# Altium schematic sheet A200T Top Level.SchDoc
size A1; SheetNumber: 2; SheetTotal: 5
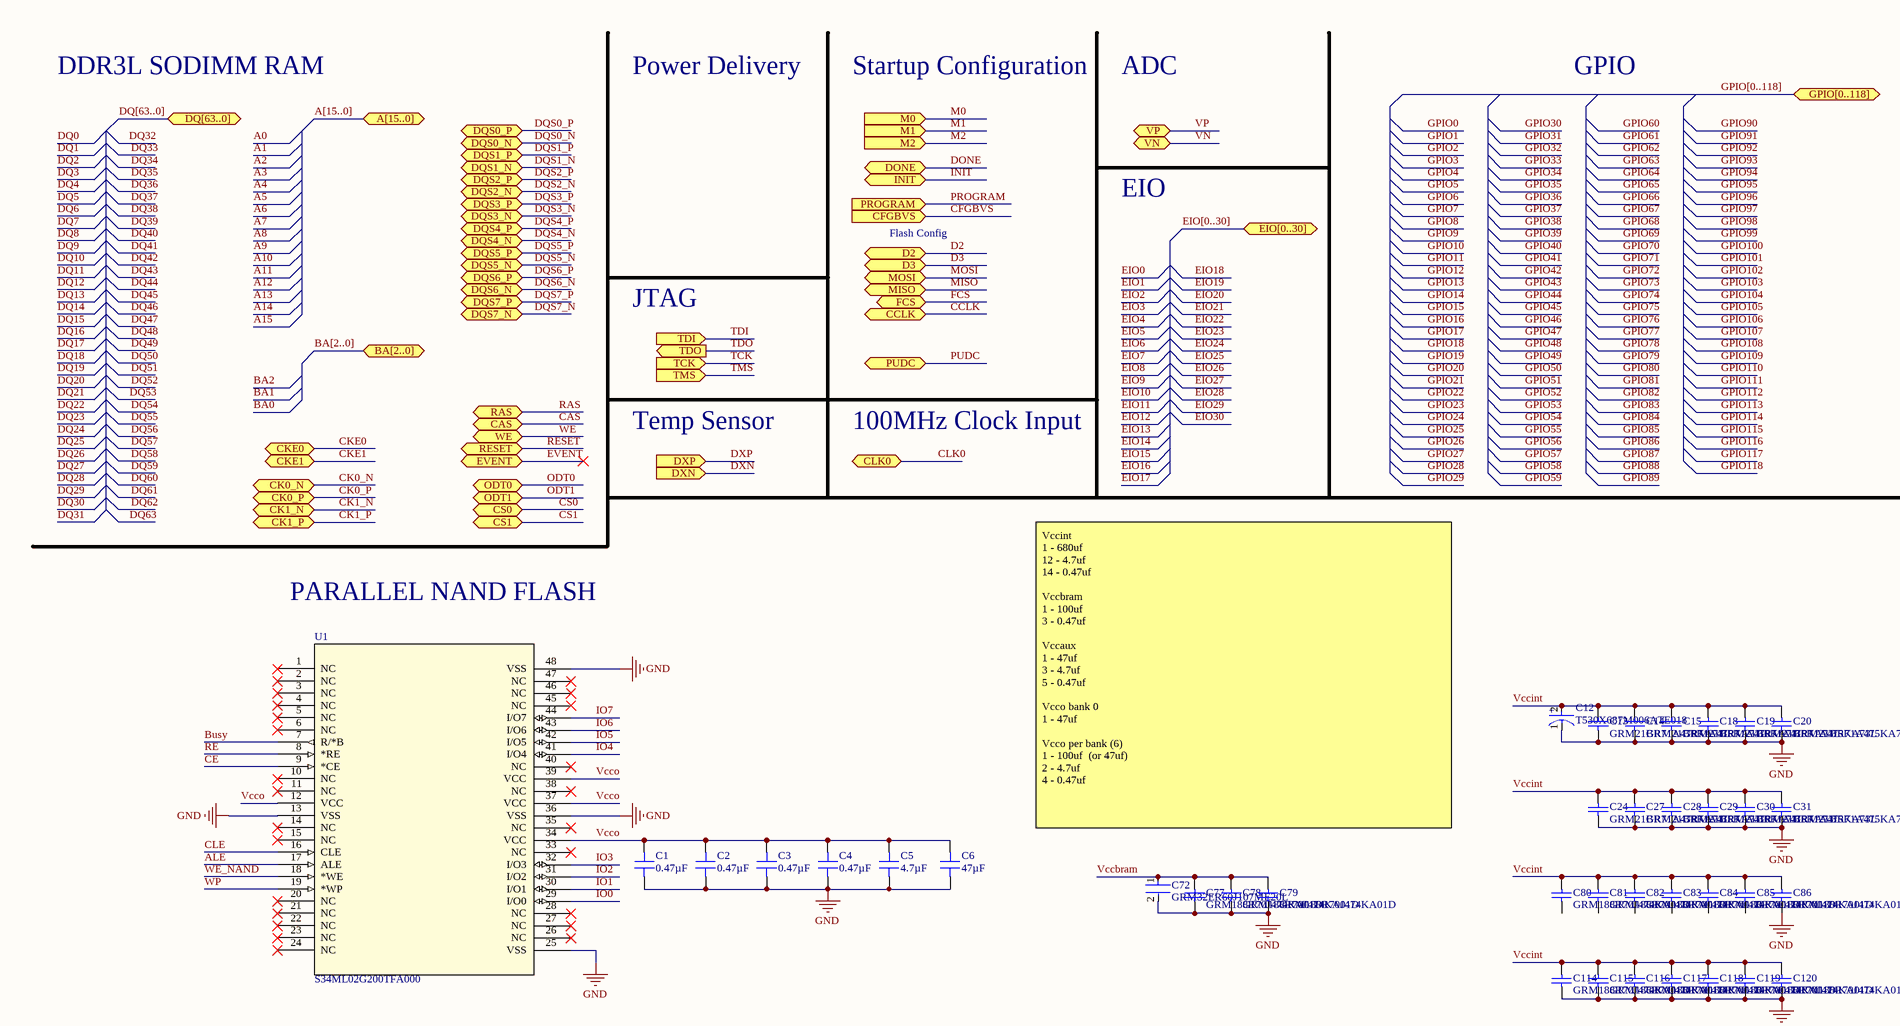
[diagram p0: A200T Top Level.SchDoc, top left]
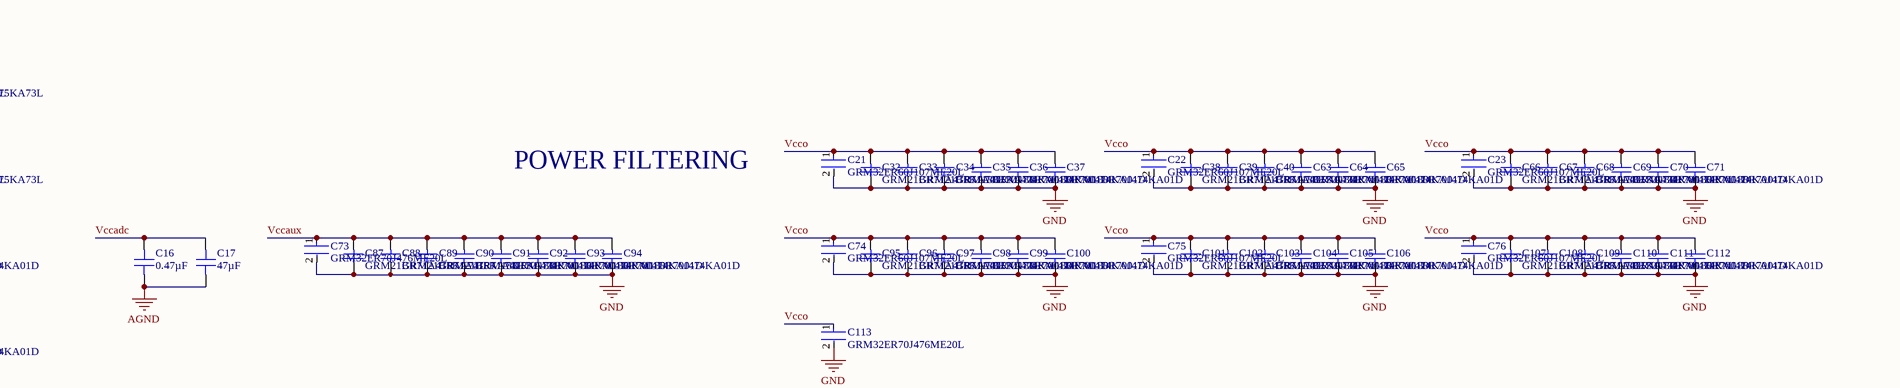
[diagram p1: A200T Top Level.SchDoc, top right]
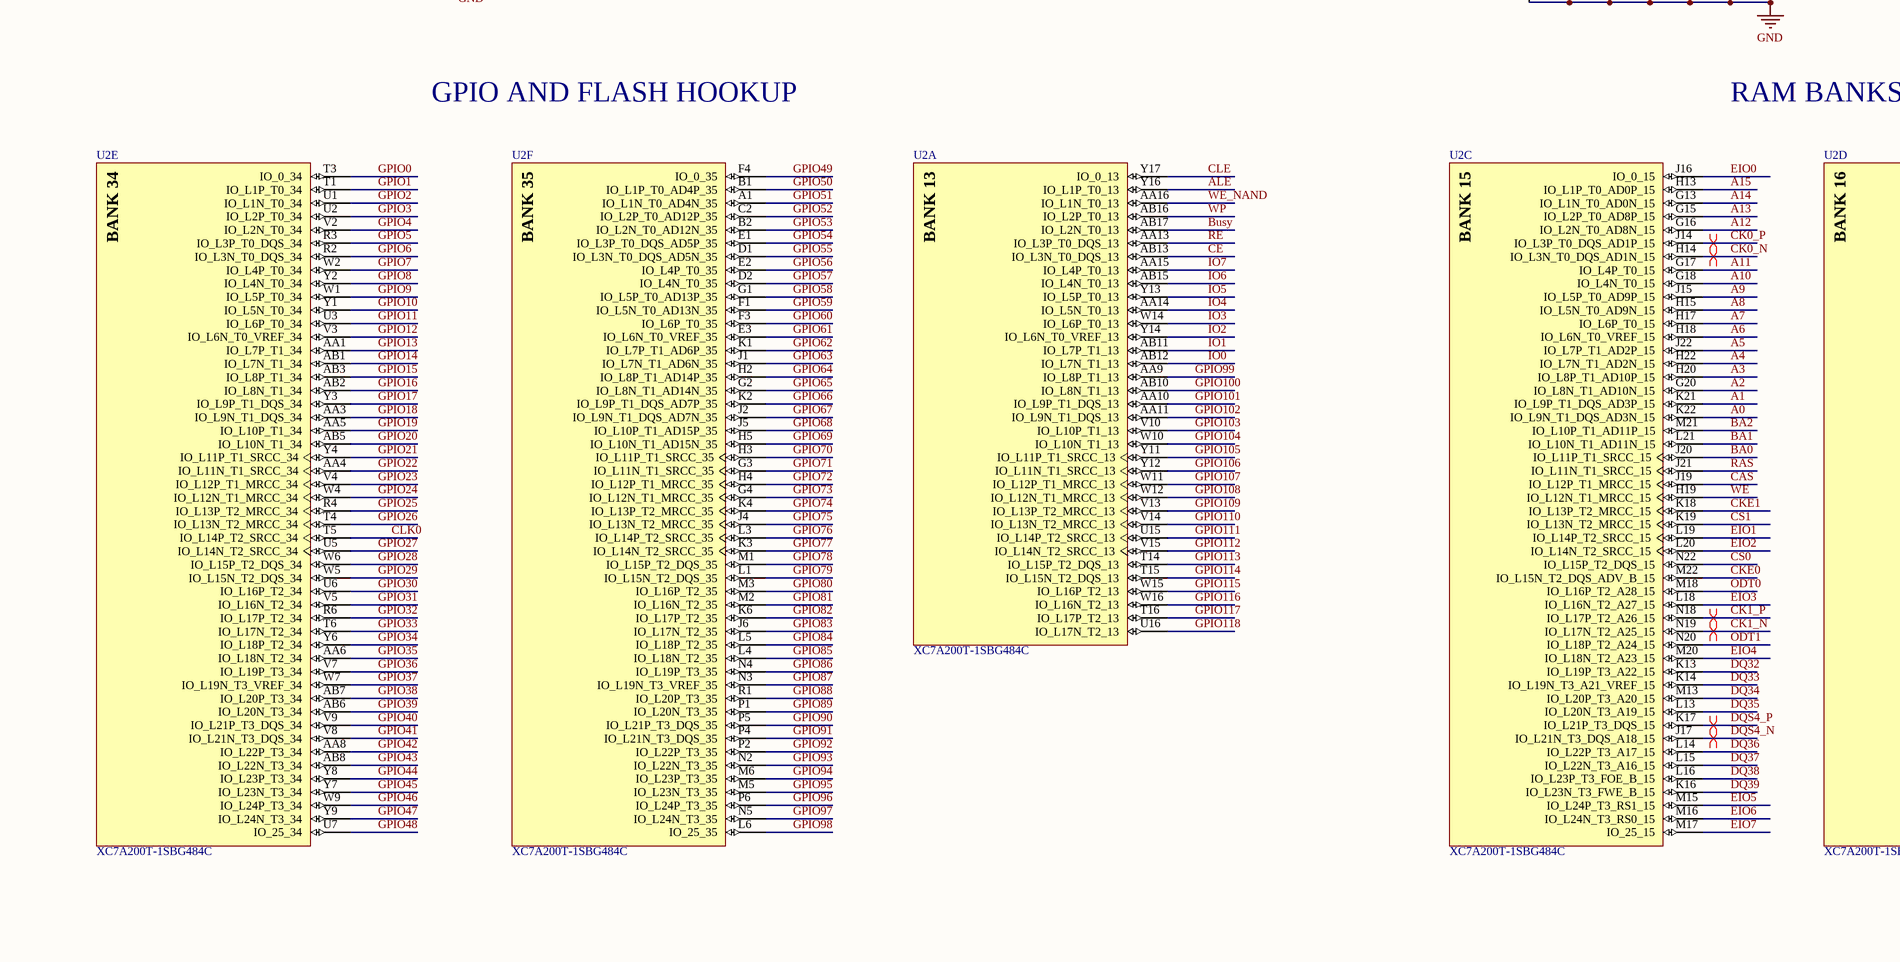
[diagram p2: A200T Top Level.SchDoc, bottom left]
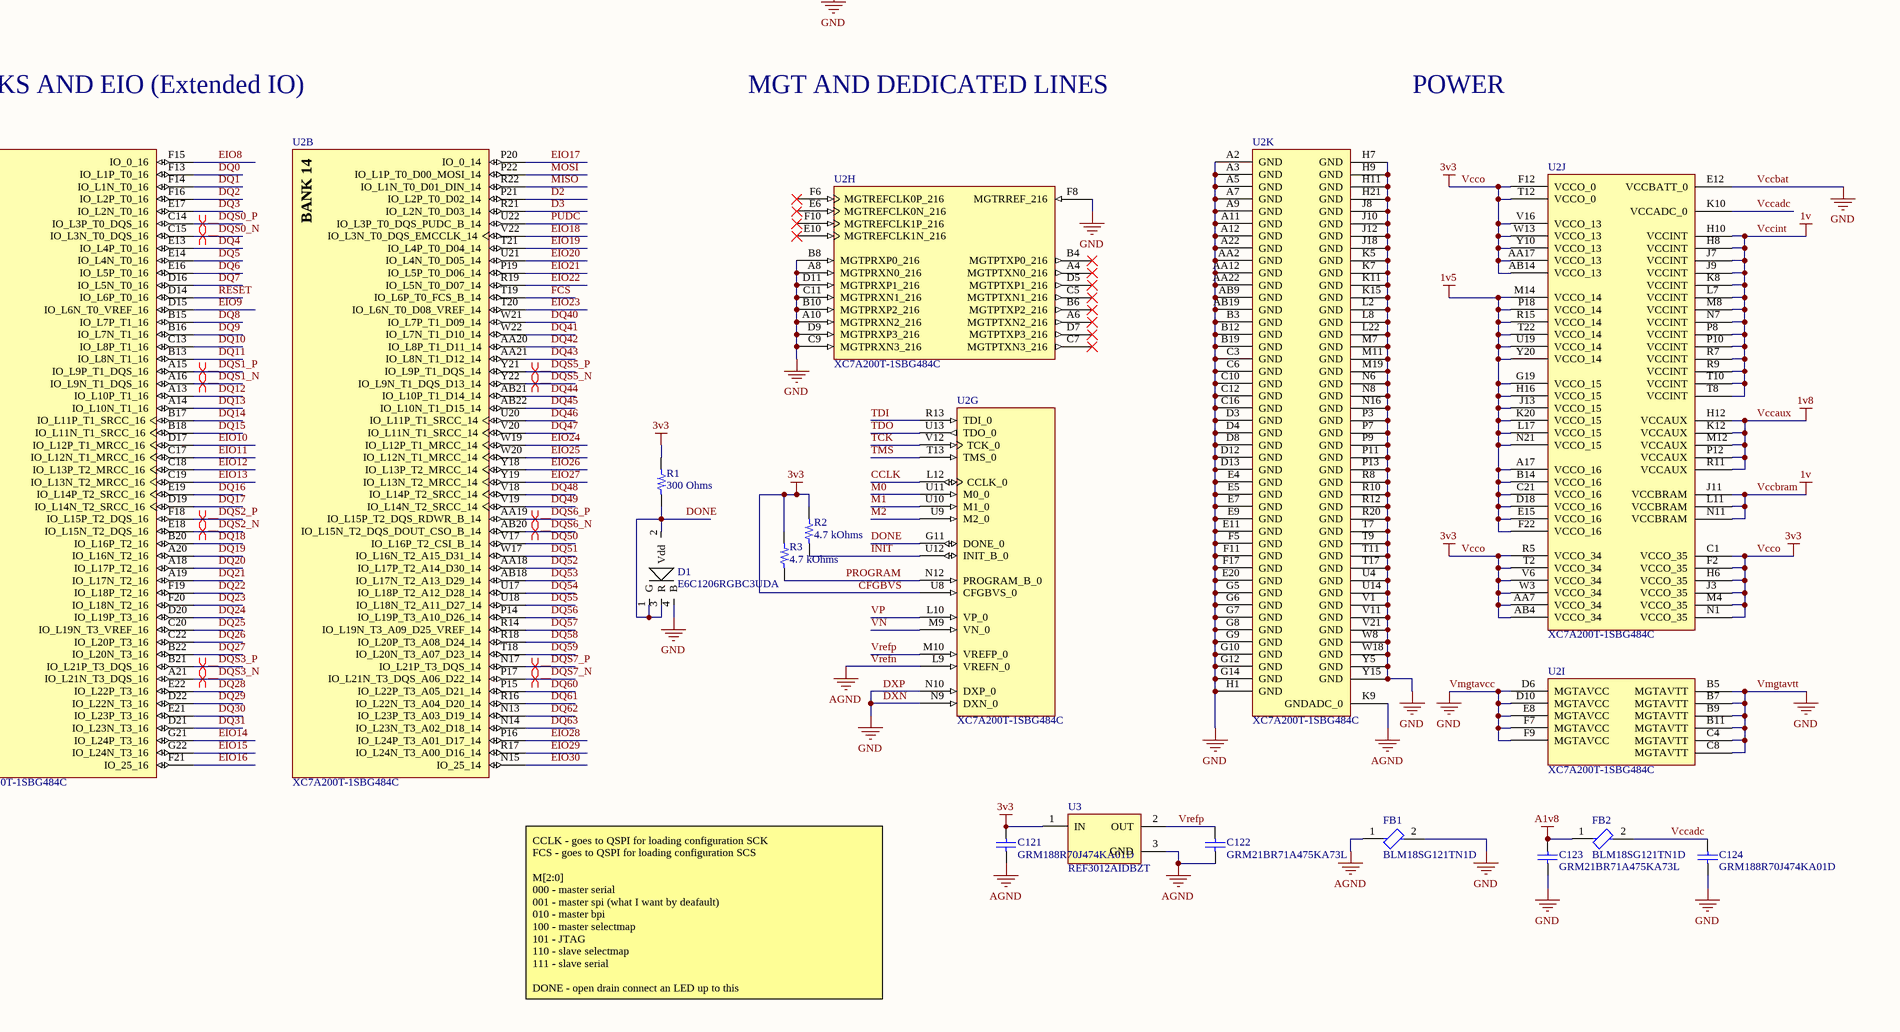
[diagram p3: A200T Top Level.SchDoc, bottom right]

## Parts
C1  0.47µF  [CAP 0603_1608]
C2  0.47µF  [CAP 0603_1608]
C3  0.47µF  [CAP 0603_1608]
C4  0.47µF  [CAP 0603_1608]
C5  4.7µF  [CAP 0603_1608]
C6  47µF  [CAP 0805_2012]
C12  T530X687M006ATE018  [FP-T530X687M006ATE018-MFG]
C13  GRM21BR71A475KA73L  [CAPC2013X135X45LL10T25]
C14  GRM21BR71A475KA73L  [CAPC2013X135X45LL10T25]
C15  GRM21BR71A475KA73L  [CAPC2013X135X45LL10T25]
C16  0.47µF  [CAP 0603_1608]
C17  47µF  [CAP 0805_2012]
C18  GRM21BR71A475KA73L  [CAPC2013X135X45LL10T25]
C19  GRM21BR71A475KA73L  [CAPC2013X135X45LL10T25]
C20  GRM21BR71A475KA73L  [CAPC2013X135X45LL10T25]
C21  GRM32ER60J107ME20L  [FP-GRM32-0_3-MFG]
C22  GRM32ER60J107ME20L  [FP-GRM32-0_3-MFG]
C23  GRM32ER60J107ME20L  [FP-GRM32-0_3-MFG]
C24  GRM21BR71A475KA73L  [CAPC2013X135X45LL10T25]
C27  GRM21BR71A475KA73L  [CAPC2013X135X45LL10T25]
C28  GRM21BR71A475KA73L  [CAPC2013X135X45LL10T25]
C29  GRM21BR71A475KA73L  [CAPC2013X135X45LL10T25]
C30  GRM21BR71A475KA73L  [CAPC2013X135X45LL10T25]
C31  GRM21BR71A475KA73L  [CAPC2013X135X45LL10T25]
C32  GRM21BR71A475KA73L  [CAPC2013X135X45LL10T25]
C33  GRM21BR71A475KA73L  [CAPC2013X135X45LL10T25]
C34  GRM188R70J474KA01D  [CAPC1608X90X35LL10T15]
C35  GRM188R70J474KA01D  [CAPC1608X90X35LL10T15]
C36  GRM188R70J474KA01D  [CAPC1608X90X35LL10T15]
C37  GRM188R70J474KA01D  [CAPC1608X90X35LL10T15]
C38  GRM21BR71A475KA73L  [CAPC2013X135X45LL10T25]
C39  GRM21BR71A475KA73L  [CAPC2013X135X45LL10T25]
C40  GRM188R70J474KA01D  [CAPC1608X90X35LL10T15]
C63  GRM188R70J474KA01D  [CAPC1608X90X35LL10T15]
C64  GRM188R70J474KA01D  [CAPC1608X90X35LL10T15]
C65  GRM188R70J474KA01D  [CAPC1608X90X35LL10T15]
C66  GRM21BR71A475KA73L  [CAPC2013X135X45LL10T25]
C67  GRM21BR71A475KA73L  [CAPC2013X135X45LL10T25]
C68  GRM188R70J474KA01D  [CAPC1608X90X35LL10T15]
C69  GRM188R70J474KA01D  [CAPC1608X90X35LL10T15]
C70  GRM188R70J474KA01D  [CAPC1608X90X35LL10T15]
C71  GRM188R70J474KA01D  [CAPC1608X90X35LL10T15]
C72  GRM32ER60J107ME20L  [FP-GRM32-0_3-MFG]
C73  GRM32ER70J476ME20L  [FP-GRM32E-0_3-0_2-IPC_C]
C74  GRM32ER60J107ME20L  [FP-GRM32-0_3-MFG]
C75  GRM32ER60J107ME20L  [FP-GRM32-0_3-MFG]
C76  GRM32ER60J107ME20L  [FP-GRM32-0_3-MFG]
C77  GRM188R70J474KA01D  [CAPC1608X90X35LL10T15]
C78  GRM188R70J474KA01D  [CAPC1608X90X35LL10T15]
C79  GRM188R70J474KA01D  [CAPC1608X90X35LL10T15]
C80  GRM188R70J474KA01D  [CAPC1608X90X35LL10T15]
C81  GRM188R70J474KA01D  [CAPC1608X90X35LL10T15]
C82  GRM188R70J474KA01D  [CAPC1608X90X35LL10T15]
C83  GRM188R70J474KA01D  [CAPC1608X90X35LL10T15]
C84  GRM188R70J474KA01D  [CAPC1608X90X35LL10T15]
C85  GRM188R70J474KA01D  [CAPC1608X90X35LL10T15]
C86  GRM188R70J474KA01D  [CAPC1608X90X35LL10T15]
C87  GRM21BR71A475KA73L  [CAPC2013X135X45LL10T25]
C88  GRM21BR71A475KA73L  [CAPC2013X135X45LL10T25]
C89  GRM21BR71A475KA73L  [CAPC2013X135X45LL10T25]
C90  GRM188R70J474KA01D  [CAPC1608X90X35LL10T15]
C91  GRM188R70J474KA01D  [CAPC1608X90X35LL10T15]
C92  GRM188R70J474KA01D  [CAPC1608X90X35LL10T15]
C93  GRM188R70J474KA01D  [CAPC1608X90X35LL10T15]
C94  GRM188R70J474KA01D  [CAPC1608X90X35LL10T15]
C95  GRM21BR71A475KA73L  [CAPC2013X135X45LL10T25]
C96  GRM21BR71A475KA73L  [CAPC2013X135X45LL10T25]
C97  GRM188R70J474KA01D  [CAPC1608X90X35LL10T15]
C98  GRM188R70J474KA01D  [CAPC1608X90X35LL10T15]
C99  GRM188R70J474KA01D  [CAPC1608X90X35LL10T15]
C100  GRM188R70J474KA01D  [CAPC1608X90X35LL10T15]
C101  GRM21BR71A475KA73L  [CAPC2013X135X45LL10T25]
C102  GRM21BR71A475KA73L  [CAPC2013X135X45LL10T25]
C103  GRM188R70J474KA01D  [CAPC1608X90X35LL10T15]
C104  GRM188R70J474KA01D  [CAPC1608X90X35LL10T15]
C105  GRM188R70J474KA01D  [CAPC1608X90X35LL10T15]
C106  GRM188R70J474KA01D  [CAPC1608X90X35LL10T15]
C107  GRM21BR71A475KA73L  [CAPC2013X135X45LL10T25]
C108  GRM21BR71A475KA73L  [CAPC2013X135X45LL10T25]
C109  GRM188R70J474KA01D  [CAPC1608X90X35LL10T15]
C110  GRM188R70J474KA01D  [CAPC1608X90X35LL10T15]
C111  GRM188R70J474KA01D  [CAPC1608X90X35LL10T15]
C112  GRM188R70J474KA01D  [CAPC1608X90X35LL10T15]
C113  GRM32ER70J476ME20L  [FP-GRM32E-0_3-0_2-IPC_C]
C114  GRM188R70J474KA01D  [CAPC1608X90X35LL10T15]
C115  GRM188R70J474KA01D  [CAPC1608X90X35LL10T15]
C116  GRM188R70J474KA01D  [CAPC1608X90X35LL10T15]
C117  GRM188R70J474KA01D  [CAPC1608X90X35LL10T15]
C118  GRM188R70J474KA01D  [CAPC1608X90X35LL10T15]
C119  GRM188R70J474KA01D  [CAPC1608X90X35LL10T15]
C120  GRM188R70J474KA01D  [CAPC1608X90X35LL10T15]
C121  GRM188R70J474KA01D  [CAPC1608X90X35LL10T15]
C122  GRM21BR71A475KA73L  [CAPC2013X135X45LL10T25]
C123  GRM21BR71A475KA73L  [CAPC2013X135X45LL10T25]
C124  GRM188R70J474KA01D  [CAPC1608X90X35LL10T15]
D1  E6C1206RGBC3UDA  [E6C1206RGBC3UDA]
FB1  BLM18SG121TN1D  [FP-BLM18-0_15-t0_5-d1_2-MFG]
FB2  BLM18SG121TN1D  [FP-BLM18-0_15-t0_5-d1_2-MFG]
R1  300 Ohms  [RES 0603_1608]
R2  4.7 kOhms  [RES 0603_1608]
R3  4.7 kOhms  [RES 0603_1608]
U1  S34ML02G200TFA000  [TSOP-48_TSOP1_SPA]
U2  XC7A200T-1SBG484C  [SBG484]  (parts A,B,C,D,E,F,G,H,I,J,K of 11)
U3  REF3012AIDBZT  [DBZ0003A_L]

## Ports
A[15..0] (bidir), BA[2..0] (bidir), CAS (bidir), CCLK (bidir), CFGBVS (in), CK0_N (bidir), CK0_P (bidir), CK1_N (bidir), CK1_P (bidir), CKE0 (bidir), CKE1 (bidir), CLK0 (bidir), CS0 (bidir), CS1 (bidir), D2 (bidir), D3 (bidir), DONE (bidir), DQ[63..0] (bidir), DQS0_N (bidir), DQS0_P (bidir), DQS1_N (bidir), DQS1_P (bidir), DQS2_N (bidir), DQS2_P (bidir), DQS3_N (bidir), DQS3_P (bidir), DQS4_N (bidir), DQS4_P (bidir), DQS5_N (bidir), DQS5_P (bidir), DQS6_N (bidir), DQS6_P (bidir), DQS7_N (bidir), DQS7_P (bidir), DXN (in), DXP (in), EIO[0..30] (bidir), EVENT (bidir), FCS (bidir), GPIO[0..118] (bidir), INIT (bidir), M0 (in), M1 (in), M2 (in), MISO (bidir), MOSI (bidir), ODT0 (bidir), ODT1 (bidir), PROGRAM (in), PUDC (bidir), RAS (bidir), RESET (bidir), TCK (in), TDI (in), TDO (out), TMS (in), VN (bidir), VP (bidir), WE (bidir)

## Nets
1v5: U2.A17(VCCO_16) U2.B14(VCCO_16) U2.C21(VCCO_16) U2.D18(VCCO_16) U2.E15(VCCO_16) U2.F22(VCCO_16) U2.G19(VCCO_15) U2.H16(VCCO_15) U2.J13(VCCO_15) U2.K20(VCCO_15) U2.L17(VCCO_15) U2.M14(VCCO_14) U2.N21(VCCO_15) U2.P18(VCCO_14) U2.R15(VCCO_14) U2.T22(VCCO_14) U2.U19(VCCO_14) U2.Y20(VCCO_14)
A1v8: C123.2 FB2.1
CFGBVS: C1.2 C2.2 C3.2 C4.2 C5.2 C6.2 C21.1 C22.1 C23.1 C32.2 C33.2 C34.2 C35.2 C36.2 C37.2 C38.2 C39.2 C40.2 C63.2 C64.2 C65.2 C66.2 C67.2 C68.2 C69.2 C70.2 C71.2 C74.1 C75.1 C76.1 C95.2 C96.2 C97.2 C98.2 C99.2 C100.2 C101.2 C102.2 C103.2 C104.2 C105.2 C106.2 C107.2 C108.2 C109.2 C110.2 C111.2 C112.2 C113.1 C121.2 R1.2 R2.2 R3.2 U1.12(VCC) U1.34(VCC) U1.37(VCC) U1.39(VCC) U2.AA7(VCCO_34) U2.AA17(VCCO_13) U2.AB4(VCCO_34) U2.AB14(VCCO_13) U2.C1(VCCO_35) U2.F2(VCCO_35) U2.F12(VCCO_0) U2.H6(VCCO_35) U2.J3(VCCO_35) U2.M4(VCCO_35) U2.N1(VCCO_35) U2.R5(VCCO_34) U2.T2(VCCO_34) U2.T12(VCCO_0) U2.U8(CFGBVS_0) U2.V6(VCCO_34) U2.V16(VCCO_13) U2.W3(VCCO_34) U2.W13(VCCO_13) U2.Y10(VCCO_13) U3.1(IN) ; port CFGBVS  [also labelled 3v3, Vcco]
DXN: C1.1 C2.1 C3.1 C4.1 C5.1 C6.1 C12.1(C) C13.1 C14.1 C15.1 C18.1 C19.1 C20.1 C21.2 C22.2 C23.2 C24.1 C27.1 C28.1 C29.1 C30.1 C31.1 C32.1 C33.1 C34.1 C35.1 C36.1 C37.1 C38.1 C39.1 C40.1 C63.1 C64.1 C65.1 C66.1 C67.1 C68.1 C69.1 C70.1 C71.1 C72.2 C73.2 C74.2 C75.2 C76.2 C77.1 C78.1 C79.1 C86.1 C87.1 C88.1 C89.1 C90.1 C91.1 C92.1 C93.1 C94.1 C95.1 C96.1 C97.1 C98.1 C99.1 C100.1 C101.1 C102.1 C103.1 C104.1 C105.1 C106.1 C107.1 C108.1 C109.1 C110.1 C111.1 C112.1 C113.2 C114.1 C115.1 C116.1 C117.1 C118.1 C119.1 C120.1 C123.1 C124.1 D1.4(B) FB1.2 U1.13(VSS) U1.25(VSS) U1.36(VSS) U1.48(VSS) U2.A2(GND) U2.A3(GND) U2.A5(GND) U2.A7(GND) U2.A8(MGTPRXN0_216) U2.A9(GND) U2.A10(MGTPRXN2_216) U2.A11(GND) U2.A12(GND) U2.A22(GND) U2.AA2(GND) U2.AA12(GND) U2.AA22(GND) U2.AB9(GND) U2.AB19(GND) U2.B3(GND) U2.B5(MGTAVTT) U2.B7(MGTAVTT) U2.B8(MGTPRXP0_216) U2.B9(MGTAVTT) U2.B10(MGTPRXP2_216) U2.B11(MGTAVTT) U2.B12(GND) U2.B19(GND) U2.C3(GND) U2.C4(MGTAVTT) U2.C6(GND) U2.C8(MGTAVTT) U2.C9(MGTPRXN3_216) U2.C10(GND) U2.C11(MGTPRXN1_216) U2.C12(GND) U2.C16(GND) U2.D3(GND) U2.D4(GND) U2.D6(MGTAVCC) U2.D8(GND) U2.D9(MGTPRXP3_216) U2.D10(MGTAVCC) U2.D11(MGTPRXP1_216) U2.D12(GND) U2.D13(GND) U2.E4(GND) U2.E5(GND) U2.E7(GND) U2.E8(MGTAVCC) U2.E9(GND) U2.E11(GND) U2.E12(VCCBATT_0) U2.E20(GND) U2.F5(GND) U2.F7(MGTAVCC) U2.F8(MGTRREF_216) U2.F9(MGTAVCC) U2.F11(GND) U2.F17(GND) U2.G5(GND) U2.G6(GND) U2.G7(GND) U2.G8(GND) U2.G9(GND) U2.G10(GND) U2.G12(GND) U2.G14(GND) U2.H1(GND) U2.H7(GND) U2.H9(GND) U2.H11(GND) U2.H21(GND) U2.J8(GND) U2.J10(GND) U2.J12(GND) U2.J18(GND) U2.K5(GND) U2.K7(GND) U2.K11(GND) U2.K15(GND) U2.L2(GND) U2.L8(GND) U2.L22(GND) U2.M7(GND) U2.M11(GND) U2.M19(GND) U2.N6(GND) U2.N8(GND) U2.N9(DXN_0) U2.N10(DXP_0) U2.N16(GND) U2.P3(GND) U2.P7(GND) U2.P9(GND) U2.P11(GND) U2.P13(GND) U2.R8(GND) U2.R10(GND) U2.R12(GND) U2.R20(GND) U2.T7(GND) U2.T9(GND) U2.T11(GND) U2.T17(GND) U2.U4(GND) U2.U14(GND) U2.V1(GND) U2.V11(GND) U2.V21(GND) U2.W8(GND) U2.W18(GND) U2.Y5(GND) U2.Y15(GND) ; port DXP, port DXN  [also labelled DXP, GND, Vccbat, Vmgtavcc, Vmgtavtt]
Vccaux: C73.1 C87.2 C88.2 C89.2 C90.2 C91.2 C92.2 C93.2 C94.2 U2.H12(VCCAUX) U2.K12(VCCAUX) U2.M12(VCCAUX) U2.P12(VCCAUX) U2.R11(VCCAUX)  [also labelled 1v8]
Vccbram: C12.2(A) C13.2 C14.2 C15.2 C18.2 C19.2 C20.2 C24.2 C27.2 C28.2 C29.2 C30.2 C31.2 C72.1 C77.2 C78.2 C79.2 C80.2 C81.2 C82.2 C83.2 C84.2 C85.2 C86.2 C114.2 C115.2 C116.2 C117.2 C118.2 C119.2 C120.2 U2.H8(VCCINT) U2.H10(VCCINT) U2.J7(VCCINT) U2.J9(VCCINT) U2.J11(VCCBRAM) U2.K8(VCCINT) U2.L7(VCCINT) U2.L11(VCCBRAM) U2.M8(VCCINT) U2.N7(VCCINT) U2.N11(VCCBRAM) U2.P8(VCCINT) U2.P10(VCCINT) U2.R7(VCCINT) U2.R9(VCCINT) U2.T8(VCCINT) U2.T10(VCCINT)  [also labelled 1v, Vccint]
Vrefn: C16.1 C17.1 C121.1 C122.1 FB1.1 U2.K9(GNDADC_0) U2.L9(VREFN_0) U3.3(GND)  [also labelled AGND]
A0: U2.K22(IO_L9N_T1_DQS_AD3N_15)
A1: U2.K21(IO_L9P_T1_DQS_AD3P_15)
A2: U2.G20(IO_L8N_T1_AD10N_15)
A3: U2.H20(IO_L8P_T1_AD10P_15)
A4: U2.H22(IO_L7N_T1_AD2N_15)
A5: U2.J22(IO_L7P_T1_AD2P_15)
A6: U2.H18(IO_L6N_T0_VREF_15)
A7: U2.H17(IO_L6P_T0_15)
A8: U2.H15(IO_L5N_T0_AD9N_15)
A9: U2.J15(IO_L5P_T0_AD9P_15)
A10: U2.G18(IO_L4N_T0_15)
A11: U2.G17(IO_L4P_T0_15)
A12: U2.G16(IO_L2N_T0_AD8N_15)
A13: U2.G15(IO_L2P_T0_AD8P_15)
A14: U2.G13(IO_L1N_T0_AD0N_15)
A15: U2.H13(IO_L1P_T0_AD0P_15)
ALE: U1.17(ALE) U2.Y16(IO_L1P_T0_13)
BA0: U2.J20(IO_L11P_T1_SRCC_15)
BA1: U2.L21(IO_L10N_T1_AD11N_15)
BA2: U2.M21(IO_L10P_T1_AD11P_15)
Busy: U1.7(R/*B) U2.AB17(IO_L2N_T0_13)
CAS: U2.J19(IO_L12P_T1_MRCC_15) ; port CAS
CCLK: U2.L12(CCLK_0) ; port CCLK
CE: U1.9(*CE) U2.AB13(IO_L3N_T0_DQS_13)
CK0_N: U2.H14(IO_L3N_T0_DQS_AD1N_15) ; port CK0_N
CK0_P: U2.J14(IO_L3P_T0_DQS_AD1P_15) ; port CK0_P
CK1_N: U2.N19(IO_L17N_T2_A25_15) ; port CK1_N
CK1_P: U2.N18(IO_L17P_T2_A26_15) ; port CK1_P
CKE0: U2.M22(IO_L15N_T2_DQS_ADV_B_15) ; port CKE0
CKE1: U2.K18(IO_L13P_T2_MRCC_15) ; port CKE1
CLE: U1.16(CLE) U2.Y17(IO_0_13)
CLK0: U2.T5(IO_L14P_T2_SRCC_34) ; port CLK0
CS0: U2.N22(IO_L15P_T2_DQS_15) ; port CS0
CS1: U2.K19(IO_L13N_T2_MRCC_15) ; port CS1
D2: U2.P21(IO_L2P_T0_D02_14) ; port D2
D3: U2.R21(IO_L2N_T0_D03_14) ; port D3
DONE: D1.1(G) D1.2(Vdd) D1.3(R) R1.1 U2.G11(DONE_0) ; port DONE
DQ0: U2.F13(IO_L1P_T0_16)
DQ1: U2.F14(IO_L1N_T0_16)
DQ2: U2.F16(IO_L2P_T0_16)
DQ3: U2.E17(IO_L2N_T0_16)
DQ4: U2.E13(IO_L4P_T0_16)
DQ5: U2.E14(IO_L4N_T0_16)
DQ6: U2.E16(IO_L5P_T0_16)
DQ7: U2.D16(IO_L5N_T0_16)
DQ8: U2.B15(IO_L7P_T1_16)
DQ9: U2.B16(IO_L7N_T1_16)
DQ10: U2.C13(IO_L8P_T1_16)
DQ11: U2.B13(IO_L8N_T1_16)
DQ12: U2.A13(IO_L10P_T1_16)
DQ13: U2.A14(IO_L10N_T1_16)
DQ14: U2.B17(IO_L11P_T1_SRCC_16)
DQ15: U2.B18(IO_L11N_T1_SRCC_16)
DQ16: U2.E19(IO_L14P_T2_SRCC_16)
DQ17: U2.D19(IO_L14N_T2_SRCC_16)
DQ18: U2.B20(IO_L16P_T2_16)
DQ19: U2.A20(IO_L16N_T2_16)
DQ20: U2.A18(IO_L17P_T2_16)
DQ21: U2.A19(IO_L17N_T2_16)
DQ22: U2.F19(IO_L18P_T2_16)
DQ23: U2.F20(IO_L18N_T2_16)
DQ24: U2.D20(IO_L19P_T3_16)
DQ25: U2.C20(IO_L19N_T3_VREF_16)
DQ26: U2.C22(IO_L20P_T3_16)
DQ27: U2.B22(IO_L20N_T3_16)
DQ28: U2.E22(IO_L22P_T3_16)
DQ29: U2.D22(IO_L22N_T3_16)
DQ30: U2.E21(IO_L23P_T3_16)
DQ31: U2.D21(IO_L23N_T3_16)
DQ32: U2.K13(IO_L19P_T3_A22_15)
DQ33: U2.K14(IO_L19N_T3_A21_VREF_15)
DQ34: U2.M13(IO_L20P_T3_A20_15)
DQ35: U2.L13(IO_L20N_T3_A19_15)
DQ36: U2.L14(IO_L22P_T3_A17_15)
DQ37: U2.L15(IO_L22N_T3_A16_15)
DQ38: U2.L16(IO_L23P_T3_FOE_B_15)
DQ39: U2.K16(IO_L23N_T3_FWE_B_15)
DQ40: U2.W21(IO_L7P_T1_D09_14)
DQ41: U2.W22(IO_L7N_T1_D10_14)
DQ42: U2.AA20(IO_L8P_T1_D11_14)
DQ43: U2.AA21(IO_L8N_T1_D12_14)
DQ44: U2.AB21(IO_L10P_T1_D14_14)
DQ45: U2.AB22(IO_L10N_T1_D15_14)
DQ46: U2.U20(IO_L11P_T1_SRCC_14)
DQ47: U2.V20(IO_L11N_T1_SRCC_14)
DQ48: U2.V18(IO_L14P_T2_SRCC_14)
DQ49: U2.V19(IO_L14N_T2_SRCC_14)
DQ50: U2.V17(IO_L16P_T2_CSI_B_14)
DQ51: U2.W17(IO_L16N_T2_A15_D31_14)
DQ52: U2.AA18(IO_L17P_T2_A14_D30_14)
DQ53: U2.AB18(IO_L17N_T2_A13_D29_14)
DQ54: U2.U17(IO_L18P_T2_A12_D28_14)
DQ55: U2.U18(IO_L18N_T2_A11_D27_14)
DQ56: U2.P14(IO_L19P_T3_A10_D26_14)
DQ57: U2.R14(IO_L19N_T3_A09_D25_VREF_14)
DQ58: U2.R18(IO_L20P_T3_A08_D24_14)
DQ59: U2.T18(IO_L20N_T3_A07_D23_14)
DQ60: U2.P15(IO_L22P_T3_A05_D21_14)
DQ61: U2.R16(IO_L22N_T3_A04_D20_14)
DQ62: U2.N13(IO_L23P_T3_A03_D19_14)
DQ63: U2.N14(IO_L23N_T3_A02_D18_14)
DQS0_N: U2.C15(IO_L3N_T0_DQS_16) ; port DQS0_N
DQS0_P: U2.C14(IO_L3P_T0_DQS_16) ; port DQS0_P
DQS1_N: U2.A16(IO_L9N_T1_DQS_16) ; port DQS1_N
DQS1_P: U2.A15(IO_L9P_T1_DQS_16) ; port DQS1_P
DQS2_N: U2.E18(IO_L15N_T2_DQS_16) ; port DQS2_N
DQS2_P: U2.F18(IO_L15P_T2_DQS_16) ; port DQS2_P
DQS3_N: U2.A21(IO_L21N_T3_DQS_16) ; port DQS3_N
DQS3_P: U2.B21(IO_L21P_T3_DQS_16) ; port DQS3_P
DQS4_N: U2.J17(IO_L21N_T3_DQS_A18_15) ; port DQS4_N
DQS4_P: U2.K17(IO_L21P_T3_DQS_15) ; port DQS4_P
DQS5_N: U2.Y22(IO_L9N_T1_DQS_D13_14) ; port DQS5_N
DQS5_P: U2.Y21(IO_L9P_T1_DQS_14) ; port DQS5_P
DQS6_N: U2.AB20(IO_L15N_T2_DQS_DOUT_CSO_B_14) ; port DQS6_N
DQS6_P: U2.AA19(IO_L15P_T2_DQS_RDWR_B_14) ; port DQS6_P
DQS7_N: U2.P17(IO_L21N_T3_DQS_A06_D22_14) ; port DQS7_N
DQS7_P: U2.N17(IO_L21P_T3_DQS_14) ; port DQS7_P
EIO0: U2.J16(IO_0_15)
EIO1: U2.L19(IO_L14P_T2_SRCC_15)
EIO2: U2.L20(IO_L14N_T2_SRCC_15)
EIO3: U2.L18(IO_L16N_T2_A27_15)
EIO4: U2.M20(IO_L18N_T2_A23_15)
EIO5: U2.M15(IO_L24P_T3_RS1_15)
EIO6: U2.M16(IO_L24N_T3_RS0_15)
EIO7: U2.M17(IO_25_15)
EIO8: U2.F15(IO_0_16)
EIO9: U2.D15(IO_L6N_T0_VREF_16)
EIO10: U2.D17(IO_L12P_T1_MRCC_16)
EIO11: U2.C17(IO_L12N_T1_MRCC_16)
EIO12: U2.C18(IO_L13P_T2_MRCC_16)
EIO13: U2.C19(IO_L13N_T2_MRCC_16)
EIO14: U2.G21(IO_L24P_T3_16)
EIO15: U2.G22(IO_L24N_T3_16)
EIO16: U2.F21(IO_25_16)
EIO17: U2.P20(IO_0_14)
EIO18: U2.V22(IO_L3N_T0_DQS_EMCCLK_14)
EIO19: U2.T21(IO_L4P_T0_D04_14)
EIO20: U2.U21(IO_L4N_T0_D05_14)
EIO21: U2.P19(IO_L5P_T0_D06_14)
EIO22: U2.R19(IO_L5N_T0_D07_14)
EIO23: U2.T20(IO_L6N_T0_D08_VREF_14)
EIO24: U2.W19(IO_L12P_T1_MRCC_14)
EIO25: U2.W20(IO_L12N_T1_MRCC_14)
EIO26: U2.Y18(IO_L13P_T2_MRCC_14)
EIO27: U2.Y19(IO_L13N_T2_MRCC_14)
EIO28: U2.P16(IO_L24P_T3_A01_D17_14)
EIO29: U2.R17(IO_L24N_T3_A00_D16_14)
EIO30: U2.N15(IO_25_14)
EVENT: port EVENT
FCS: U2.T19(IO_L6P_T0_FCS_B_14) ; port FCS
GPIO0: U2.T3(IO_0_34)
GPIO1: U2.T1(IO_L1P_T0_34)
GPIO2: U2.U1(IO_L1N_T0_34)
GPIO3: U2.U2(IO_L2P_T0_34)
GPIO4: U2.V2(IO_L2N_T0_34)
GPIO5: U2.R3(IO_L3P_T0_DQS_34)
GPIO6: U2.R2(IO_L3N_T0_DQS_34)
GPIO7: U2.W2(IO_L4P_T0_34)
GPIO8: U2.Y2(IO_L4N_T0_34)
GPIO9: U2.W1(IO_L5P_T0_34)
GPIO10: U2.Y1(IO_L5N_T0_34)
GPIO11: U2.U3(IO_L6P_T0_34)
GPIO12: U2.V3(IO_L6N_T0_VREF_34)
GPIO13: U2.AA1(IO_L7P_T1_34)
GPIO14: U2.AB1(IO_L7N_T1_34)
GPIO15: U2.AB3(IO_L8P_T1_34)
GPIO16: U2.AB2(IO_L8N_T1_34)
GPIO17: U2.Y3(IO_L9P_T1_DQS_34)
GPIO18: U2.AA3(IO_L9N_T1_DQS_34)
GPIO19: U2.AA5(IO_L10P_T1_34)
GPIO20: U2.AB5(IO_L10N_T1_34)
GPIO21: U2.Y4(IO_L11P_T1_SRCC_34)
GPIO22: U2.AA4(IO_L11N_T1_SRCC_34)
GPIO23: U2.V4(IO_L12P_T1_MRCC_34)
GPIO24: U2.W4(IO_L12N_T1_MRCC_34)
GPIO25: U2.R4(IO_L13P_T2_MRCC_34)
GPIO26: U2.T4(IO_L13N_T2_MRCC_34)
GPIO27: U2.U5(IO_L14N_T2_SRCC_34)
GPIO28: U2.W6(IO_L15P_T2_DQS_34)
GPIO29: U2.W5(IO_L15N_T2_DQS_34)
GPIO30: U2.U6(IO_L16P_T2_34)
GPIO31: U2.V5(IO_L16N_T2_34)
GPIO32: U2.R6(IO_L17P_T2_34)
GPIO33: U2.T6(IO_L17N_T2_34)
GPIO34: U2.Y6(IO_L18P_T2_34)
GPIO35: U2.AA6(IO_L18N_T2_34)
GPIO36: U2.V7(IO_L19P_T3_34)
GPIO37: U2.W7(IO_L19N_T3_VREF_34)
GPIO38: U2.AB7(IO_L20P_T3_34)
GPIO39: U2.AB6(IO_L20N_T3_34)
GPIO40: U2.V9(IO_L21P_T3_DQS_34)
GPIO41: U2.V8(IO_L21N_T3_DQS_34)
GPIO42: U2.AA8(IO_L22P_T3_34)
GPIO43: U2.AB8(IO_L22N_T3_34)
GPIO44: U2.Y8(IO_L23P_T3_34)
GPIO45: U2.Y7(IO_L23N_T3_34)
GPIO46: U2.W9(IO_L24P_T3_34)
GPIO47: U2.Y9(IO_L24N_T3_34)
GPIO48: U2.U7(IO_25_34)
GPIO49: U2.F4(IO_0_35)
GPIO50: U2.B1(IO_L1P_T0_AD4P_35)
GPIO51: U2.A1(IO_L1N_T0_AD4N_35)
GPIO52: U2.C2(IO_L2P_T0_AD12P_35)
GPIO53: U2.B2(IO_L2N_T0_AD12N_35)
GPIO54: U2.E1(IO_L3P_T0_DQS_AD5P_35)
GPIO55: U2.D1(IO_L3N_T0_DQS_AD5N_35)
GPIO56: U2.E2(IO_L4P_T0_35)
GPIO57: U2.D2(IO_L4N_T0_35)
GPIO58: U2.G1(IO_L5P_T0_AD13P_35)
GPIO59: U2.F1(IO_L5N_T0_AD13N_35)
GPIO60: U2.F3(IO_L6P_T0_35)
GPIO61: U2.E3(IO_L6N_T0_VREF_35)
GPIO62: U2.K1(IO_L7P_T1_AD6P_35)
GPIO63: U2.J1(IO_L7N_T1_AD6N_35)
GPIO64: U2.H2(IO_L8P_T1_AD14P_35)
GPIO65: U2.G2(IO_L8N_T1_AD14N_35)
GPIO66: U2.K2(IO_L9P_T1_DQS_AD7P_35)
GPIO67: U2.J2(IO_L9N_T1_DQS_AD7N_35)
GPIO68: U2.J5(IO_L10P_T1_AD15P_35)
GPIO69: U2.H5(IO_L10N_T1_AD15N_35)
GPIO70: U2.H3(IO_L11P_T1_SRCC_35)
GPIO71: U2.G3(IO_L11N_T1_SRCC_35)
GPIO72: U2.H4(IO_L12P_T1_MRCC_35)
GPIO73: U2.G4(IO_L12N_T1_MRCC_35)
GPIO74: U2.K4(IO_L13P_T2_MRCC_35)
GPIO75: U2.J4(IO_L13N_T2_MRCC_35)
GPIO76: U2.L3(IO_L14P_T2_SRCC_35)
GPIO77: U2.K3(IO_L14N_T2_SRCC_35)
GPIO78: U2.M1(IO_L15P_T2_DQS_35)
GPIO79: U2.L1(IO_L15N_T2_DQS_35)
GPIO80: U2.M3(IO_L16P_T2_35)
GPIO81: U2.M2(IO_L16N_T2_35)
GPIO82: U2.K6(IO_L17P_T2_35)
GPIO83: U2.J6(IO_L17N_T2_35)
GPIO84: U2.L5(IO_L18P_T2_35)
GPIO85: U2.L4(IO_L18N_T2_35)
GPIO86: U2.N4(IO_L19P_T3_35)
GPIO87: U2.N3(IO_L19N_T3_VREF_35)
GPIO88: U2.R1(IO_L20P_T3_35)
GPIO89: U2.P1(IO_L20N_T3_35)
GPIO90: U2.P5(IO_L21P_T3_DQS_35)
GPIO91: U2.P4(IO_L21N_T3_DQS_35)
GPIO92: U2.P2(IO_L22P_T3_35)
GPIO93: U2.N2(IO_L22N_T3_35)
GPIO94: U2.M6(IO_L23P_T3_35)
GPIO95: U2.M5(IO_L23N_T3_35)
GPIO96: U2.P6(IO_L24P_T3_35)
GPIO97: U2.N5(IO_L24N_T3_35)
GPIO98: U2.L6(IO_25_35)
GPIO99: U2.AA9(IO_L8P_T1_13)
GPIO100: U2.AB10(IO_L8N_T1_13)
GPIO101: U2.AA10(IO_L9P_T1_DQS_13)
GPIO102: U2.AA11(IO_L9N_T1_DQS_13)
GPIO103: U2.V10(IO_L10P_T1_13)
GPIO104: U2.W10(IO_L10N_T1_13)
GPIO105: U2.Y11(IO_L11P_T1_SRCC_13)
GPIO106: U2.Y12(IO_L11N_T1_SRCC_13)
GPIO107: U2.W11(IO_L12P_T1_MRCC_13)
GPIO108: U2.W12(IO_L12N_T1_MRCC_13)
GPIO109: U2.V13(IO_L13P_T2_MRCC_13)
GPIO110: U2.V14(IO_L13N_T2_MRCC_13)
GPIO111: U2.U15(IO_L14P_T2_SRCC_13)
GPIO112: U2.V15(IO_L14N_T2_SRCC_13)
GPIO113: U2.T14(IO_L15P_T2_DQS_13)
GPIO114: U2.T15(IO_L15N_T2_DQS_13)
GPIO115: U2.W15(IO_L16P_T2_13)
GPIO116: U2.W16(IO_L16N_T2_13)
GPIO117: U2.T16(IO_L17P_T2_13)
GPIO118: U2.U16(IO_L17N_T2_13)
INIT: R2.1 U2.U12(INIT_B_0) ; port INIT
IO0: U1.29(I/O0) U2.AB12(IO_L7N_T1_13)
IO1: U1.30(I/O1) U2.AB11(IO_L7P_T1_13)
IO2: U1.31(I/O2) U2.Y14(IO_L6N_T0_VREF_13)
IO3: U1.32(I/O3) U2.W14(IO_L6P_T0_13)
IO4: U1.41(I/O4) U2.AA14(IO_L5N_T0_13)
IO5: U1.42(I/O5) U2.Y13(IO_L5P_T0_13)
IO6: U1.43(I/O6) U2.AB15(IO_L4N_T0_13)
IO7: U1.44(I/O7) U2.AA15(IO_L4P_T0_13)
M0: U2.U11(M0_0) ; port M0
M1: U2.U10(M1_0) ; port M1
M2: U2.U9(M2_0) ; port M2
MISO: U2.R22(IO_L1N_T0_D01_DIN_14) ; port MISO
MOSI: U2.P22(IO_L1P_T0_D00_MOSI_14) ; port MOSI
ODT0: U2.M18(IO_L16P_T2_A28_15) ; port ODT0
ODT1: U2.N20(IO_L18P_T2_A24_15) ; port ODT1
PROGRAM: R3.1 U2.N12(PROGRAM_B_0) ; port PROGRAM
PUDC: U2.U22(IO_L3P_T0_DQS_PUDC_B_14) ; port PUDC
RAS: U2.J21(IO_L11N_T1_SRCC_15) ; port RAS
RE: U1.8(*RE) U2.AA13(IO_L3P_T0_DQS_13)
RESET: U2.D14(IO_L6P_T0_16) ; port RESET
TCK: U2.V12(TCK_0) ; port TCK
TDI: U2.R13(TDI_0) ; port TDI
TDO: U2.U13(TDO_0) ; port TDO
TMS: U2.T13(TMS_0) ; port TMS
Vccadc: C16.2 C17.2 C124.2 FB2.2 U2.K10(VCCADC_0)
VN: U2.M9(VN_0) ; port VN
VP: U2.L10(VP_0) ; port VP
Vrefp: C122.2 U2.M10(VREFP_0) U3.2(OUT)
WE: U2.H19(IO_L12N_T1_MRCC_15) ; port WE
WE_NAND: U1.18(*WE) U2.AA16(IO_L1N_T0_13)
WP: U1.19(*WP) U2.AB16(IO_L2P_T0_13)

Not connected (* = marked no-connect by the designer): C80 1; C81 1; C82 1; C83 1; C84 1; C85 1; U1 1(NC)* 2(NC)* 3(NC)* 4(NC)* 5(NC)* 6(NC)* 10(NC)* 11(NC)* 14(NC)* 15(NC)* 20(NC)* 21(NC)* 22(NC)* 23(NC)* 24(NC)* 26(NC)* 27(NC)* 28(NC)* 33(NC)* 35(NC)* 38(NC)* 40(NC)* 45(NC)* 46(NC)* 47(NC)*; U2 A4(MGTPTXN0_216)* A6(MGTPTXN2_216)* B4(MGTPTXP0_216)* B6(MGTPTXP2_216)* C5(MGTPTXN1_216)* C7(MGTPTXN3_216)* D5(MGTPTXP1_216)* D7(MGTPTXP3_216)* E6(MGTREFCLK0N_216)* E10(MGTREFCLK1N_216)* F6(MGTREFCLK0P_216)* F10(MGTREFCLK1P_216)*

## Buses and harness runs
bus A[15..0] = port A[15..0]
bus BA[2..0] = port BA[2..0]
bus DQ[63..0] = port DQ[63..0]
bus EIO[0..30] = port EIO[0..30]
bus GPIO[0..118] = port GPIO[0..118]

## Layout directives
differential pair: CK0_N, CK0_P, CK1_N, CK1_P, DQS0_N, DQS0_P, DQS1_N, DQS1_P, DQS2_N, DQS2_P, DQS3_N, DQS3_P, DQS4_N, DQS4_P, DQS5_N, DQS5_P, DQS6_N, DQS6_P, DQS7_N, DQS7_P

## Notes on the sheet
- DDR3L SODIMM RAM
- Power Delivery
- Startup Configuration
- ADC
- GPIO
- Flash Config
- EIO
- JTAG
- Temp Sensor
- 100MHz Clock Input
- PARALLEL NAND FLASH
- Vccint
  1 - 680uf
  12 - 4.7uf
  14 - 0.47uf
  Vccbram
  1 - 100uf
  3 - 0.47uf
  Vccaux
  1 - 47uf
  3 - 4.7uf
  5 - 0.47uf
  Vcco bank 0
  1 - 47uf
  Vcco per bank (6)
  1 - 100uf  (or 47uf)
  2 - 4.7uf
  4 - 0.47uf
- POWER FILTERING
- GPIO AND FLASH HOOKUP
- RAM BANKS AND EIO (Extended IO)
- MGT AND DEDICATED LINES
- POWER
- CCLK - goes to QSPI for loading configuration SCK
  FCS - goes to QSPI for loading configuration SCS
  M[2:0]
  000 - master serial
  001 - master spi (what I want by deafault)
  010 - master bpi
  100 - master selectmap
  101 - JTAG
  110 - slave selectmap
  111 - slave serial
  DONE - open drain connect an LED up to this
- (in symbol CMP-03017-000009-1) +
- (in symbol XC7A200T-1SBG484C, part A) BANK 13
- (in symbol XC7A200T-1SBG484C, part B) BANK 14
- (in symbol XC7A200T-1SBG484C, part C) BANK 15
- (in symbol XC7A200T-1SBG484C, part D) BANK 16
- (in symbol XC7A200T-1SBG484C, part E) BANK 34
- (in symbol XC7A200T-1SBG484C, part F) BANK 35

## Library data of the parts
C1-C4 C16 = 885012106015: CAP CER 0.47UF 16V X5R 0603; Manufacturer: Würth Elektronik; Tolerance: ±20%; Part Number: 885012106015; Value: 0.47µF; Applications: General Purpose; Capacitance: 0.47µF; ComponentLink1Description: Datasheet; ComponentLink1URL: https://katalog.we-online.de/pbs/datasheet/885012106015.pdf; ComponentLink2Description: DigiKey Link; ComponentLink2URL: http://digikey.com/product-detail/en/w-rth-elektronik/885012106015/732-7912-1-ND/5454539; Device Package: 0603 (1608 Metric); LastUpdated: 2020-09-02 1:03:18 AM; Lifecycle Status: Active; Minimum Order: 1; Mounting Type: Surface Mount, MLCC; Operating Temperature: -55°C ~ 85°C; Package / Case: 0603 (1608 Metric); Packaging: TapeAndReel; PartId: 11963; Part Status: Active; Price: 0.04; Series: WCAP-CSGP; Size / Dimension: 0.063" L x 0.031" W (1.60mm x 0.80mm); Supplier 1: DigiKey; Supplier Part Number 1: 732-7912-1-ND; Temperature Coefficient: X5R; Thickness (Max): 0.037" (0.95mm); Voltage - Rated: 16V
C5 = CL10A475KQ8NNNC: CAP CER 4.7UF 6.3V X5R 0603; Manufacturer: Samsung Electro-Mechanics; Tolerance: ±10%; Part Number: CL10A475KQ8NNNC; Value: 4.7µF; Applications: General Purpose; Capacitance: 4.7µF; ComponentLink1Description: Datasheet; ComponentLink1URL: http://www.samsungsem.com/kr/support/product-search/mlcc/CL10A475KQ8NNNC.jsp; ComponentLink2Description: DigiKey Link; ComponentLink2URL: http://digikey.com/product-detail/en/samsung-electro-mechanics/CL10A475KQ8NNNC/1276-1045-1-ND/3889131; Device Package: 0603 (1608 Metric); LastUpdated: 2020-09-02 1:03:30 AM; Lifecycle Status: Active; Minimum Order: 1; Mounting Type: Surface Mount, MLCC; Operating Temperature: -55°C ~ 85°C; Package / Case: 0603 (1608 Metric); Packaging: TapeAndReel; PartId: 5557; Part Status: Active; Price: 0.01; Series: CL; Size / Dimension: 0.063" L x 0.031" W (1.60mm x 0.80mm); Supplier 1: DigiKey; Supplier Part Number 1: 1276-1045-1-ND; Temperature Coefficient: X5R; Thickness (Max): 0.035" (0.90mm); Voltage - Rated: 6.3V
C6 C17 = GRM21BR61A476ME15L: CAP CER 47UF 10V X5R 0805; Manufacturer: Murata Electronics; Tolerance: ±20%; Part Number: GRM21BR61A476ME15L; Value: 47µF; Applications: General Purpose; Capacitance: 47µF; ComponentLink1Description: Datasheet; ComponentLink1URL: https://search.murata.co.jp/Ceramy/image/img/A01X/G101/ENG/GRM21BR61A476ME15-01.pdf; ComponentLink2Description: DigiKey Link; ComponentLink2URL: http://digikey.com/product-detail/en/murata-electronics/GRM21BR61A476ME15L/490-9961-1-ND/5026442; Device Package: 0805 (2012 Metric); LastUpdated: 2020-09-02 1:04:38 AM; Lifecycle Status: Active; Minimum Order: 1; Mounting Type: Surface Mount, MLCC; Operating Temperature: -55°C ~ 85°C; Package / Case: 0805 (2012 Metric); Packaging: TapeAndReel; PartId: 4627; Part Status: Active; Price: 0.19; Series: GRM; Size / Dimension: 0.079" L x 0.049" W (2.00mm x 1.25mm); Supplier 1: DigiKey; Supplier Part Number 1: 490-9961-1-ND; Temperature Coefficient: X5R; Thickness (Max): 0.057" (1.45mm); Voltage - Rated: 10V
C12 = CMP-03017-000009-1: CAP TANT POLY 680UF 6.3V 2917; Ripple Current: 3.9A; Polarity: Polar; Dissipation Factor: 8%; Tolerance: 20%; ESR (Equivalent Series Resistance): 18mR; Leakage Current: 428uA; Case Code (Imperial): 2917; Voltage Rating: 6.3V; Features: General Purpose; Height - Seated (Max): 0.169inch; Construction: Flat; Capacitance: 680uF; Length: 7.3mm; Mount: Surface Mount; Case Code (Metric): 7343; Package Quantity: 1; Height: 4.3mm; Packaging: Tape and Reel; Min Operating Temperature: -55°C; REACH SVHC: No SVHC; Radiation Hardening: No; Voltage Rating (DC): 6.3V; Termination: SMD/SMT; Max Operating Temperature: 125°C; RoHS Compliant: Yes; Depth: 4.3mm; Series: KO-CAP T530; Case/Package: 2917; Width: 0.169inch
C13-C15 C18-C20 C24 C27-C33 C38 C39 C66 C67 C87-C89 C95 C96 C101 C102 C107 C108 C122 C123 = CMP-2007-03555-1: Manufacturer: Murata; Part Number: GRM21BR71A475KA73L
C21-C23 C72 C74-C76 = CMP-2000-05259-2: CAP CER 100UF 6.3V X5R 1210; 3DS Part Number: 220-00002; Manufacturer: Murata; Temperature Coefficient: 15%; Material: Ceramic; Tolerance: 20%; Octopart: https://octopart.com/grm32er60j107me20l-murata-197007; ComponentLink2URL: https://search.murata.co.jp/Ceramy/image/img/A01X/G101/ENG/GRM32ER60J107ME20-01.pdf; Temperature Range High: +85°C; RoHS: TRUE; Device Class L3: Ceramic Capacitors; Manufacturer Part Number: GRM32ER60J107ME20L; Device Class L2: Capacitors; Voltage: 6.3V; Package: GRM32-0.3; Voltage Rating: 6.3V; Category: Cap; Device Class L1: Passive Components; Temperature Characteristic: X5R; Automotive: No; Digikey Description: CAP CER 100UF 6.3V X5R 1210; Temperature: -55°C to +85°C; Height: 2.7mm; Ipc Land Pattern Name: CAPC320250X250; Capacitance: 100uF; Temperature Range Low: -55°C; Lead Free: Yes; Value: 100uF; ComponentLink2Description: Datasheet
C34-C37 C40 C63-C65 C68-C71 C77-C86 C90-C94 C97-C100 C103-C106 C109-C112 C114-C121 C124 = CMP-2006-02830-1: Manufacturer: Murata; Part Number: GRM188R70J474KA01D
C73 C113 = CMP-06035-057102-1: Chip Multilayer Ceramic Capacitors for General Purpose, 1210, 47uF, X7R, 15%, 20%, 6.3V; Capacitance: 47uF; Radiation Hardening: No; Termination: SMD/SMT; Lead Free: Lead Free; Length: 3.2mm; Depth: 2.5mm; Thickness: 0.106inch; Case Code (Metric): 3225; Width: 0.098inch; Dielectric: X7R; Case/Package: 1210; Mount: Surface Mount; Packaging: Tape and Reel; Package Quantity: 1; Height: 2.5mm; Tolerance: 20%; Max Operating Temperature: 125°C; Voltage Rating (DC): 6.3V; Case Code (Imperial): 1210; Min Operating Temperature: -55°C; Voltage Rating: 6.3V
FB1 FB2 = CMP-0686-00602-4: Chip Ferrite Bead, 0603, 120Ω @ 100MHz, 25%, 0.025Ω, 3A; DC Resistance (DCR): 25mR; Shielding: Unshielded; Material: Steel; Number of Circuits: 1; Impedance: 120R; Tolerance: 25%; REACH SVHC: No SVHC; Case/Package: 0603; Max DC Current: 3A; Core Material: Ferrite; Case Code (Metric): 1608; Frequency: 100MHz; Package Quantity: 1; Height: 0.8mm; Lead Free: Lead Free; Test Frequency: 100MHz; RoHS Compliant: Yes; DC Resistance-Max: 25mR; Min Operating Temperature: -55°C; Width: 0.8mm; Termination: SMD/SMT; Length: 1.6mm; Max Current Rating: 3A; Number of Lines: 1; Series: BLM18S; Number of Pins: 2; Packaging: Tape and Reel; Current Rating: 3A; Depth: 0.8mm; Case Code (Imperial): 0603; Max Operating Temperature: 125°C
R1 = RK73H1JTTD3000F: RES 300 OHM 1% 1/8W 0603; Manufacturer: KOA Speer Electronics, Inc.; Power (Watts): 0.125W, 1/8W; Temperature Coefficient: ±100ppm/°C; Part Number: RK73H1JTTD3000F; Value: 300 Ohms; ComponentLink1Description: Datasheet; ComponentLink1URL: http://www.koaspeer.com/catimages/Products/RK73H/RK73H.pdf; ComponentLink2Description: DigiKey Link; ComponentLink2URL: https://www.digikey.com/en/products/detail/koa-speer-electronics-inc/RK73H1JTTD3000F/9844965; Composition: Thick Film; Device Package: 0603 (1608 Metric); Features: Automotive AEC-Q200, Moisture Resistant; Height - Seated (Max): 0.022" (0.55mm); LastUpdated: 2023-09-28 7:33:50 PM; Lifecycle Status: Active; Minimum Order: 1; Number of Terminations: 2; Operating Temperature: -55°C ~ 155°C; Package / Case: 0603 (1608 Metric); Packaging: CutTape; PartId: 22569; Part Status: Active; Price: 0.01; Ratings: AEC-Q200; Resistance: 300 Ohms; Series: RK73H; Size / Dimension: 0.063" L x 0.031" W (1.60mm x 0.80mm); Supplier 1: DigiKey; Supplier Part Number 1: 2019-RK73H1JTTD3000FCT-ND; Supplier Device Package: 0603; Tolerance: ±1%
R2 R3 = RC0603FR-074K7L: RES 4.7K OHM 1% 1/10W 0603; Manufacturer: Yageo; Power (Watts): 0.1W, 1/10W; Temperature Coefficient: ±100ppm/°C; Part Number: RC0603FR-074K7L; Value: 4.7 kOhms; ComponentLink1Description: Datasheet; ComponentLink1URL: https://www.yageo.com/upload/media/product/productsearch/datasheet/rchip/PYu-RC_Group_51_RoHS_L_10.pdf; ComponentLink2Description: DigiKey Link; ComponentLink2URL: https://www.digikey.com/en/products/detail/yageo/RC0603FR-074K7L/727212; Composition: Thick Film; Device Package: 0603 (1608 Metric); Features: Moisture Resistant; Height - Seated (Max): 0.022" (0.55mm); LastUpdated: 2023-09-28 7:33:40 PM; Lifecycle Status: Active; Minimum Order: 1; Number of Terminations: 2; Operating Temperature: -55°C ~ 155°C; Package / Case: 0603 (1608 Metric); Packaging: CutTape; PartId: 23949; Part Status: Active; Price: 0.01; Resistance: 4.7 kOhms; Series: RC_L; Size / Dimension: 0.063" L x 0.031" W (1.60mm x 0.80mm); Supplier 1: DigiKey; Supplier Part Number 1: 311-4.70KHRCT-ND; Supplier Device Package: 0603; Tolerance: ±1%
U1 = S34ML02G200TFA000: No Description Available; Mfr_Name: Cypress Semiconductor; Copyright: Copyright (C) 2021 Ultra Librarian. All rights reserved.; Manufacturer_Part_Number: S34ML02G200TFA000; Digi-Key_Part_Number_1: 428-4274-ND; Digi-Key_Part_Number_2: 2120-S34MS01G200TFI000-ND; Digi-Key_Part_Number_3: 2832-S34MS01G200TFI000-ND; RefDes: RefDes; Type: DEV
U2 = XC7A200T-1SBG484C: Artix-7 FPGA, 285 User I/Os, 4 GTP, 484-Ball BGA, Speed Grade 1, Commercial Grade, Pb-Free; Manufacturer: Xilinx; Block RAM Blocks (18Kb): 730; Block RAM Blocks (36Kb): 365; Block RAM Blocks (Max Kb): 13140; CLBs (Slices): 33650; Clock Mgmt Tiles (CMTs): 10; DSP48E1 Slices: 740; Logic Cells: 215360; Max User I/O: 500; Speed Grade: -1; DatasheetVersion: v1.12; PackageVersion: Rev 1.8; PackageReference: SBG484; PackageDescription: Flip-Chip Lidless BGA, Body 19 x 19 mm, 0.8 mm Pitch; Supplier 1: Digi-Key; Supplier Part Number 1: 122-1867-ND; CLBs (Max Distributed RAM Kb): 2888; Generic Part Number: XC7A200T; RoHS: Pb-Free; NexusDeviceID: XC7A200T-1SBG484C; Mounting Technology: Surface Mount; Code_JEDEC: MO-275-PPA2; PartNumber: XC7A200T-1SBG484C; ComponentLink1Description: Manufacturer URL; ComponentLink1URL: http://www.xilinx.com/; ComponentLink2Description: Datasheet; ComponentLink2URL: http://www.xilinx.com/support/documentation/data_sheets/ds180_7Series_Overview.pdf; ComponentLink3Description: Package Specification; ComponentLink3URL: http://www.xilinx.com/support/documentation/user_guides/ug475_7Series_Pkg_Pinout.pdf; ComponentLink4Description: DC and Switching Characteristics; ComponentLink4URL: http://www.xilinx.com/support/documentation/data_sheets/ds181_Artix_7_Data_Sheet.pdf; ComponentLink5Description: Package File; ComponentLink5URL: http://www.xilinx.com/support/packagefiles/a7packages/xc7a200tsbg484pkg.txt; ComponentLink6Description: Packaging and Pinout; ComponentLink6URL: http://www.xilinx.com/support/documentation/user_guides/ug475_7Series_Pkg_Pinout.pdf
U3 = CMP-0367-00158-2: 1.25 V, 50 ppm / degC, 50 uA Series (Bandgap) Voltage Reference, -40 to 125 degC, 3-pin SOT-23 (DBZ), Green (RoHS & no Sb/Br); Manufacturer: Texas Instruments; Iq(Max)(uA): 50; Initial Accuracy @ 25/deg C(%): 0.2; Rating: Catalog; VI(Max)(V): 5.5; VI(Min)(V): 1.8; Temp Coeff(Typ)(ppm/ degree C): 20; SubFamily: Series Voltage Reference; VO(V): 1.25; ComponentLink1Description: Manufacturer URL; ComponentLink1URL: http://www.ti.com/; PartNumber: REF3012AIDBZT; PackageDescription: 3-Pin Plastic Small Outline, Body 2.92 x 1.3 mm, Pitch 0.95 mm; Mounting Technology: Surface Mount; Eco-Plan: Green (RoHS & no Sb/Br); PackageVersion: 4203227/B; ComponentLink2URL: http://www.ti.com/general/docs/lit/getliterature.tsp?genericPartNumber=REF3012&fileType=pdf; ComponentLink2Description: Datasheet; Temp Coeff(Max)(ppm/ degree C): 50; Code_JEDEC: TO-236; PackageReference: DBZ0003A; ComponentLink3Description: Package Specification; DatasheetVersion: SBVS032F; ComponentLink3URL: http://www.ti.com/litv/pdf/mpds108a